# Altium schematic sheet Power_Supply.SchDoc
size A4; Author: Conor Farrell; SheetNumber: 4; SheetTotal: 6
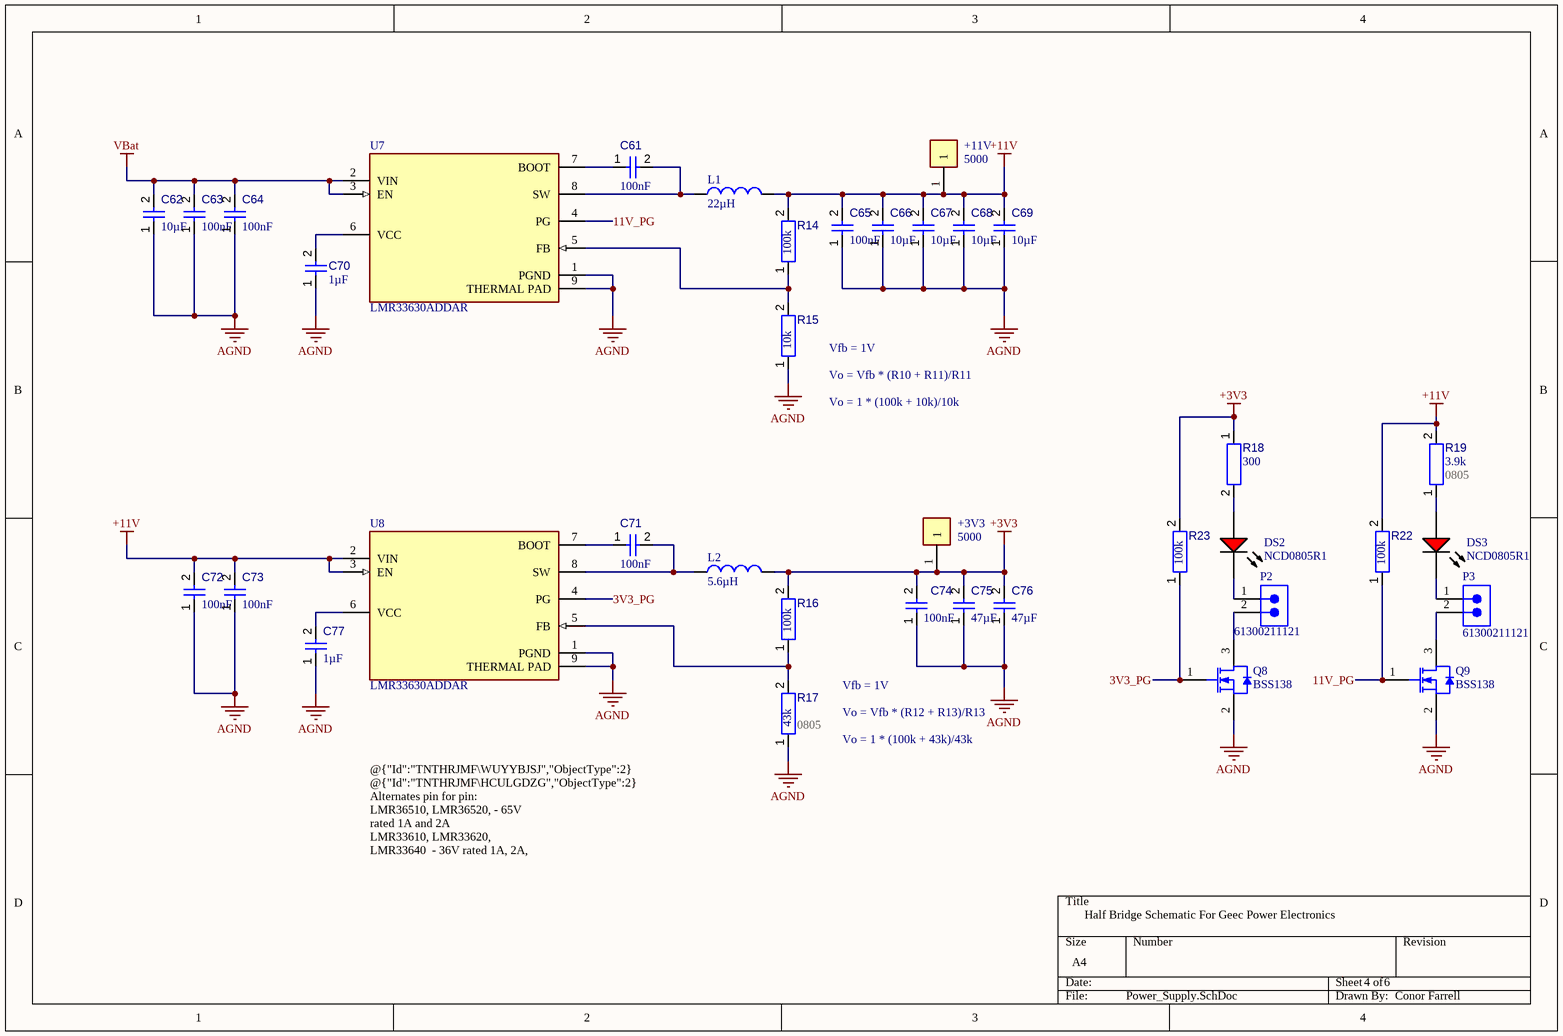
[diagram p0: Power_Supply.SchDoc]

## Parts
+3V3  5000  [FP-5000-MFG]
+11V  5000  [FP-5000-MFG]
C61  value 100nF  [CAPC3216X190X55ML30T25]  (hidden comment: CL31B104KBCNNNC)
C62  value 10µF  [FP-GCM32E-0_3-IPC_C]  (hidden comment: GCM32EC71H106KA03L)
C63  value 100nF  [CAPC3216X190X55ML30T25]  (hidden comment: CL31B104KBCNNNC)
C64  value 100nF  [CAPC3216X190X55ML30T25]  (hidden comment: CL31B104KBCNNNC)
C65  value 100nF  [CAPC3216X190X55ML30T25]  (hidden comment: CL31B104KBCNNNC)
C66  value 10µF  [FP-GCM32E-0_3-IPC_C]  (hidden comment: GCM32EC71H106KA03L)
C67  value 10µF  [FP-GCM32E-0_3-IPC_C]  (hidden comment: GCM32EC71H106KA03L)
C68  value 10µF  [FP-GCM32E-0_3-IPC_C]  (hidden comment: GCM32EC71H106KA03L)
C69  value 10µF  [FP-GCM32E-0_3-IPC_C]  (hidden comment: GCM32EC71H106KA03L)
C70  value 1µF  [CAPC3216X180X20ML20]  (hidden comment: CL31B105KBHNNNE)
C71  value 100nF  [CAPC3216X190X55ML30T25]  (hidden comment: CL31B104KBCNNNC)
C72  value 100nF  [CAPC3216X190X55ML30T25]  (hidden comment: CL31B104KBCNNNC)
C73  value 100nF  [CAPC3216X190X55ML30T25]  (hidden comment: CL31B104KBCNNNC)
C74  value 100nF  [CAPC3216X190X55ML30T25]  (hidden comment: CL31B104KBCNNNC)
C75  value 47µF  [CAPC3216X190X55LL30T25]  (hidden comment: CL31A476MPHNNNE)
C76  value 47µF  [CAPC3216X190X55LL30T25]  (hidden comment: CL31A476MPHNNNE)
C77  value 1µF  [CAPC3216X180X20ML20]  (hidden comment: CL31B105KBHNNNE)
DS2  NCD0805R1  [Copy of WL-SMCW_0805_150080xx75000]
DS3  NCD0805R1  [Copy of WL-SMCW_0805_150080xx75000]
L1  value 22µH  [INDP127127X85N]  (hidden comment: SRR1208-220ML)
L2  value 5.6µH  [INDP125125X60N]  (hidden comment: SRR1260A-5R6Y)
P2  61300211121  [61300211121]
P3  61300211121  [61300211121]
Q8  BSS138  [FAIR-SOT23-3_V]
Q9  BSS138  [FAIR-SOT23-3_V]
R14  value 100k  [RESC3216X60X45NL15T20]  (hidden comment: 1206W4F1003T5E)
R15  value 10k  [RESC3216X60X45ML15T20]  (hidden comment: 1206W4F1002T5E)
R16  value 100k  [RESC3216X60X45NL15T20]  (hidden comment: 1206W4F1003T5E)
R17  value 43k  Case/Package: 0805  [RESC0805(2012)_L]  (hidden comment: 0805W8F4302T5E)
R18  value 300  [RESC3216X89X51NL25T25]  (hidden comment: 1206W4F3000T5E)
R19  value 3.9k  Case/Package: 0805  [RESC2013X60X35ML10T20]  (hidden comment: 0805W8F3901T5E)
R22  value 100k  [RESC3216X60X45NL15T20]  (hidden comment: 1206W4F1003T5E)
R23  value 100k  [RESC3216X60X45NL15T20]  (hidden comment: 1206W4F1003T5E)
U7  LMR33630ADDAR  [SOIC127P600X170_HS-9N]
U8  LMR33630ADDAR  [SOIC127P600X170_HS-9N]

## Nets
+3V3: +3V3.1 C74.2 C75.2 C76.2 L2.2 R16.2 R18.1 R23.2
+11V: +11V.1 C65.2 C66.2 C67.2 C68.2 C69.2 C72.2 C73.2 L1.2 R14.2 R19.2 R22.2 U8.2(VIN) U8.3(EN)
AGND: C62.1 C63.1 C64.1 C65.1 C66.1 C67.1 C68.1 C69.1 C70.1 C72.1 C73.1 C74.1 C75.1 C76.1 C77.1 Q8.2(S) Q9.2(S) R15.1 R17.1 U7.1(PGND) U7.9(THERMAL_PAD) U8.1(PGND) U8.9(THERMAL_PAD)
VBat: C62.2 C63.2 C64.2 U7.2(VIN) U7.3(EN)
3V3_PG: Q8.1(G) R23.1 U8.4(PG)
11V_PG: Q9.1(G) R22.1 U7.4(PG)
NetC61_1: C61.1 U7.7(BOOT)
NetC61_2: C61.2 L1.1 U7.8(SW)
NetC70_2: C70.2 U7.6(VCC)
NetC71_1: C71.1 U8.7(BOOT)
NetC71_2: C71.2 L2.1 U8.8(SW)
NetC77_2: C77.2 U8.6(VCC)
NetDS2_1: DS2.1(A) R18.2
NetDS2_2: DS2.2(K) P2.1
NetDS3_1: DS3.1(A) R19.1
NetDS3_2: DS3.2(K) P3.1
NetP2_2: P2.2 Q8.3(D)
NetP3_2: P3.2 Q9.3(D)
NetR14_1: R14.1 R15.2 U7.5(FB)
NetR16_1: R16.1 R17.2 U8.5(FB)

## Notes on the sheet
- (near R15) Vfb = 1V
- (near R15) Vo = Vfb * (R10 + R11)/R11
- Vo = 1 * (100k + 10k)/10k
- Vfb = 1V
- Vo = Vfb * (R12 + R13)/R13
- Vo = 1 * (100k + 43k)/43k
- @{"Id":"TNTHRJMF\WUYYBJSJ","ObjectType":2} @{"Id":"TNTHRJMF\HCULGDZG","ObjectType":2}
  Alternates pin for pin:
  LMR36510, LMR36520, - 65V rated 1A and 2A
  LMR33610, LMR33620, LMR33640  - 36V rated 1A, 2A, 4A
- Half Bridge Schematic For Geec Power Electronics

## Library data of the parts
+3V3 +11V = CMP-00030-00004-2: Cable Wrap, 1/2 Inch, Polyethylene, Natural, 50 Ft, Spirap Series; Hole Diameter: 1.6mm; Mounting Technology: PCB, Through Hole; Color: Red
C61 C63-C65 C71-C74 = CMP-001-00089-1: 50V 100nF X7R ±10% 1206 Multilayer Ceramic Capacitors MLCC - SMD/SMT ROHS; Min Operating Temperature: -55°C; Mounting Technology: Surface Mount; Case/Package: 1206; Max Operating Temperature: 125°C; JLCPN: C24497; Voltage Rating: 50V; Tolerance: 10%
C62 C66-C69 = CMP-001-00085-1: 50V 10uF X7S ±10% 1210 Multilayer Ceramic Capacitors MLCC - SMD/SMT ROHS; Tolerance: 10%; Max Operating Temperature: 125°C; Case Code (Metric): 3225; Mounting Technology: Surface Mount; Case/Package: 1210; Min Operating Temperature: -55°C; Voltage Rating: 50V; Dielectric: X7S
C70 C77 = CMP-001-00086-1: Ceramic Capacitor, Multilayer, Ceramic, 50V, 10% +Tol, 10% -Tol, X7R, +-15% TC, 1uF, Surface Mount, 1206 inch; Mounting Technology: Surface Mount; JLCPN: C1848; Max Operating Temperature: 125°C; Min Operating Temperature: -55°C; Case/Package: 1206; Tolerance: 10%; Voltage Rating: 50V
C75 C76 = CMP-001-00087-1: Ceramic Capacitor, Multilayer, Ceramic, 10V, 20% +Tol, 20% -Tol, X5R, +-15% TC, 47uF, Surface Mount, 1206 inch; Voltage Rating: 10V; JLCPN: C96123; Mounting Technology: Surface Mount; Case/Package: 1206; Max Operating Temperature: 85°C; Tolerance: 20%; Min Operating Temperature: -55°C
DS2 DS3 = CMP-002-00586-1: 25mA Colorless Transparent Lens 67mcd~195mcd -30℃~+85℃ 615nm~630nm Independent Diode Red 130° 65mW 1.6V~2.6V 0805 LED...; pin to pad: 1>2 2>1; Case/Package: 0805; JLCPN: C84256
L1 = CMP-006-00022-1: Inductor Power Shielded Wirewound 22uH 20% 1KHz 23Q-Factor Ferrite 3.5A 0.043Ohm DCR T/R; Self Resonant Frequency: 7MHz; Tolerance: 20%; Max Operating Temperature: 125°C; Max Current Rating: 3.5A; Mounting Technology: Surface Mount; JLCPN: C2041332; Min Operating Temperature: -40°C; Case/Package: 5050; Current Rating: 3.5A; Pins: 2
L2 = CMP-006-00023-1: Ind Power Shielded Wirewound 5.6uH 30% 100KHz 19Q-Factor Ferrite 6.7A T/R; DC Resistance (DCR): 16.2mΩ; Self Resonant Frequency: 33MHz; Tolerance: 30%; JLCPN: C2042812; Max Operating Temperature: 125°C; Current Rating: 6.7A; Case/Package: Nonstandard; Max Current Rating: 6.7A; Mounting Technology: Surface Mount; Min Operating Temperature: -40°C
P2 P3 = CMP-002-00208-1: WR-PHD Pin Header, THT, Vertical, pitch 2.54mm, 1 Row, 2P; Manufacturer: Wurth Elektronik; Withstanding Voltage: 500V; Rated Current: 3A; Contact Resistance: 20mOhm; Working Voltage: 250V; Source: WR-PHD.SchLib; Mount: Through Hole; ComponentLink1Description: Website Link; Operating Temperature Max: 105°C; ComponentLink1URL: https://www.we-online.com/redexpert/article/61300211121?ad; Category: Board-to-Board Connectors; ComponentLink2URL: https://www.we-online.com/redexpert/spec/61300211121?ad; Number of Rows: 1; Orientation: Vertical; ComponentLink2Description: Datasheet Link; Operating Temperature Min: -40°C; Manufacturer Part Number: 61300211121; Match Code: WR-PHD; Design Item ID: 61300211121; Component Type: Standard; Pin Count: 2; Gender: Pin Header; Pitch: 2.54mm; Packaging: Bag; Pins: 2
Q8 Q9 = CMP-013-00021-4: N-Channel Logic Level Enhancement Mode Field Effect Transistor, 220 mA, 50 V, -55 to 150 degC, 3-Pin SOT-23, RoHS, Tape and Reel; Manufacturer: Fairchild; Elements: 1; Nominal Vgs: 1.3V; Resistance: 0.7Ohm; Typical Rise Time: 9ns; Rds On Max: 3.5Ohm; Nominal Dual Supply Voltage: 50V; Input Capacitance: 27pF; Package Version: Rev. 12, 03/2016; Power: 360mW; Packaging: TapeandReel; Package Description: 3-Pin Small Outline Transistor, Body 2.92 x 1.325 mm, Pitch 0.95 mm; Datasheet URL: https://www.fairchildsemi.com/datasheets/BS/BSS138.pdf; Min Operating Temperature: -55°C; Pins: 3; RoHS Compliant: True; Package Reference: SOT23-3; Package Quantity: 1; Case/Package: TO-236-3; Mounting Technology: SM; Max Operating Temperature: 150°C; Datasheet Version: Rev. C, 10/2005
R14 R16 R22 R23 = CMP-009-00185-1: Fixed Resistor, Metal Glaze/thick Film, 0.25W, 100000ohm, 200V, 1% +/-Tol, 100ppm/Cel, Surface Mount, 1206; Mounting Technology: Surface Mount; Tolerance: 1%; Min Operating Temperature: -55°C; Max Operating Temperature: 155°C
R15 = CMP-009-00184-2: Res Thick Film 1206 10K Ohm 1% 0.25W(1/4W) ±100ppm/C Pad SMD T/R; JLCPN: C17902; Case/Package: 1206
R17 = CMP-009-00188-1: 125mW Thick Film Resistors 150V ±100ppm/℃ ±1% 43kΩ 0805 Chip Resistor - Surface Mount ROHS; Tolerance: 1%; Power: 125mW; JLCPN: C17695
R18 = CMP-009-00190-1: 250mW Thick Film Resistors 200V ±100ppm/℃ ±1% 300Ω 1206 Chip Resistor - Surface Mount ROHS
R19 = CMP-009-00193-2: Res Thick Film 0805 3.9K Ohm 1% 0.125W(1/8W) ±100ppm/C Pad SMD T/R; Power: 125mW; JLCPN: C17614
U7 U8 = CMP-019-00051-2: SIMPLE SWITCHER® 3.8V to 36V, 3A Synchronous Buck Converter With Ultra-Low EMI 8-SO PowerPAD -40 to 125; Nominal Supply Current: 24µA; Pins: 8; Max Supply Voltage: 36V; Max Operating Temperature: 125°C; Min Operating Temperature: -40°C; Min Supply Voltage: 3.8V; Output Current: 3A; Topology: Buck